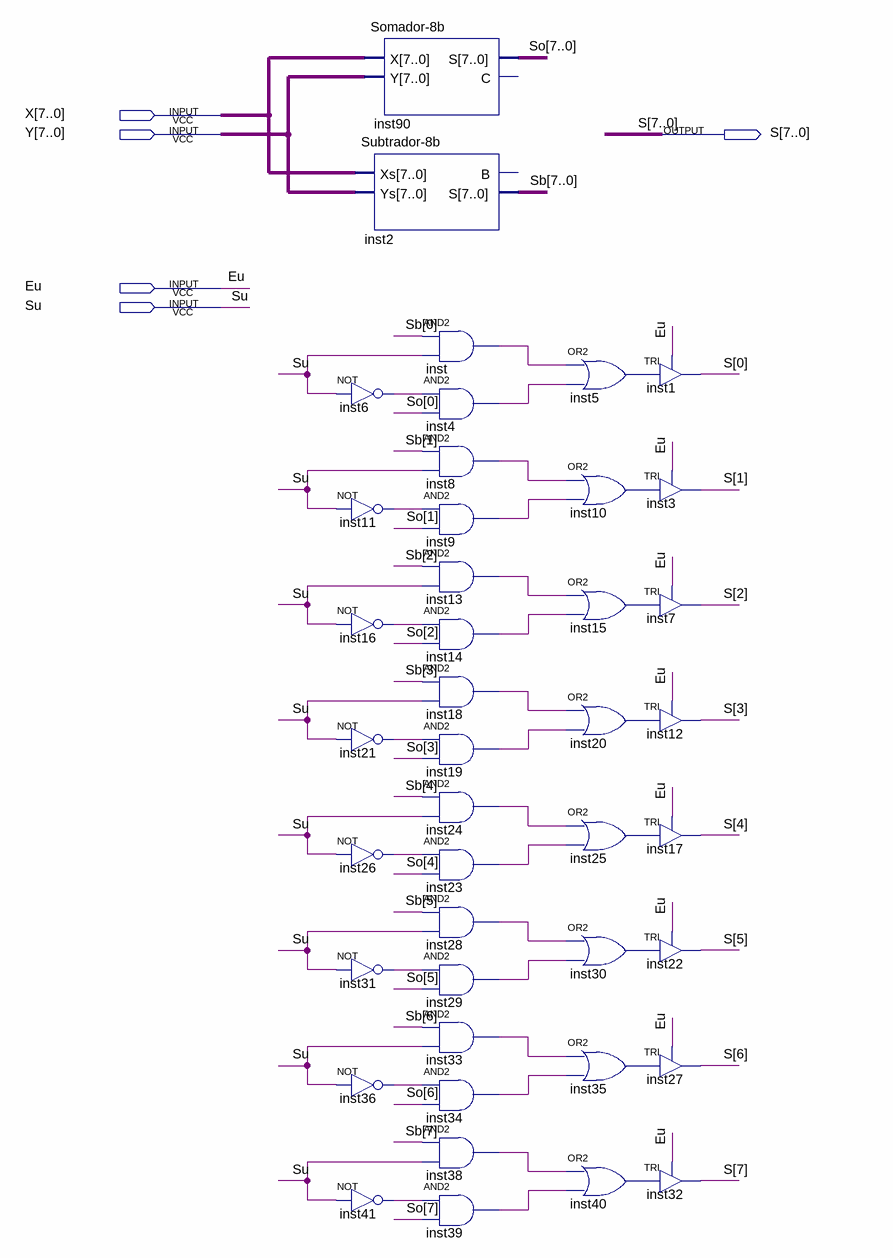
[diagram p0: schematic sheet]
// Quartus schematic Somador-Subtrador.bdf as structural Verilog: 42 symbols, 5 pins
module \Somador-Subtrador  (
  input  [7:0] X,
  input  [7:0] Y,
  input  Eu,
  input  Su,
  output [7:0] S
);

  wire inst4_out, inst5_out, inst6_out, inst8_out, inst9_out, inst10_out, inst11_out, inst13_out, inst14_out,
       inst15_out, inst16_out, inst18_out, inst19_out, inst20_out, inst21_out, inst23_out, inst24_out,
       inst25_out, inst26_out, inst28_out, inst29_out, inst30_out, inst31_out, inst33_out, inst34_out,
       inst35_out, inst36_out, inst38_out, inst39_out, inst40_out, inst41_out, inst_out;
  wire [7:0] Sb, So;

  \Somador-8b  inst90 (.X(X), .Y(Y), .S(So));  // open: C
  \Subtrador-8b  inst2 (.Xs(X), .Ys(Y), .S(Sb));  // open: B
  not inst6 (inst6_out, Su);
  not inst11 (inst11_out, Su);
  not inst16 (inst16_out, Su);
  not inst21 (inst21_out, Su);
  not inst26 (inst26_out, Su);
  not inst31 (inst31_out, Su);
  not inst36 (inst36_out, Su);
  not inst41 (inst41_out, Su);
  and inst (inst_out, Sb[0], Su);
  and inst4 (inst4_out, inst6_out, So[0]);
  and inst8 (inst8_out, Sb[1], Su);
  and inst9 (inst9_out, inst11_out, So[1]);
  and inst13 (inst13_out, Sb[2], Su);
  and inst14 (inst14_out, inst16_out, So[2]);
  and inst18 (inst18_out, Sb[3], Su);
  and inst19 (inst19_out, inst21_out, So[3]);
  and inst24 (inst24_out, Sb[4], Su);
  and inst23 (inst23_out, inst26_out, So[4]);
  and inst28 (inst28_out, Sb[5], Su);
  and inst29 (inst29_out, inst31_out, So[5]);
  and inst33 (inst33_out, Sb[6], Su);
  and inst34 (inst34_out, inst36_out, So[6]);
  and inst38 (inst38_out, Sb[7], Su);
  and inst39 (inst39_out, inst41_out, So[7]);
  or inst5 (inst5_out, inst_out, inst4_out);
  or inst10 (inst10_out, inst8_out, inst9_out);
  or inst15 (inst15_out, inst13_out, inst14_out);
  or inst20 (inst20_out, inst18_out, inst19_out);
  or inst25 (inst25_out, inst24_out, inst23_out);
  or inst30 (inst30_out, inst28_out, inst29_out);
  or inst35 (inst35_out, inst33_out, inst34_out);
  or inst40 (inst40_out, inst38_out, inst39_out);
  TRI inst1 (.IN(inst5_out), .OE(Eu), .OUT(S[0]));
  TRI inst3 (.IN(inst10_out), .OE(Eu), .OUT(S[1]));
  TRI inst7 (.IN(inst15_out), .OE(Eu), .OUT(S[2]));
  TRI inst12 (.IN(inst20_out), .OE(Eu), .OUT(S[3]));
  TRI inst17 (.IN(inst25_out), .OE(Eu), .OUT(S[4]));
  TRI inst22 (.IN(inst30_out), .OE(Eu), .OUT(S[5]));
  TRI inst27 (.IN(inst35_out), .OE(Eu), .OUT(S[6]));
  TRI inst32 (.IN(inst40_out), .OE(Eu), .OUT(S[7]));
endmodule
